# EasyEDA Pro project 数控电源_V3.eprj, board 屏幕排线fpc
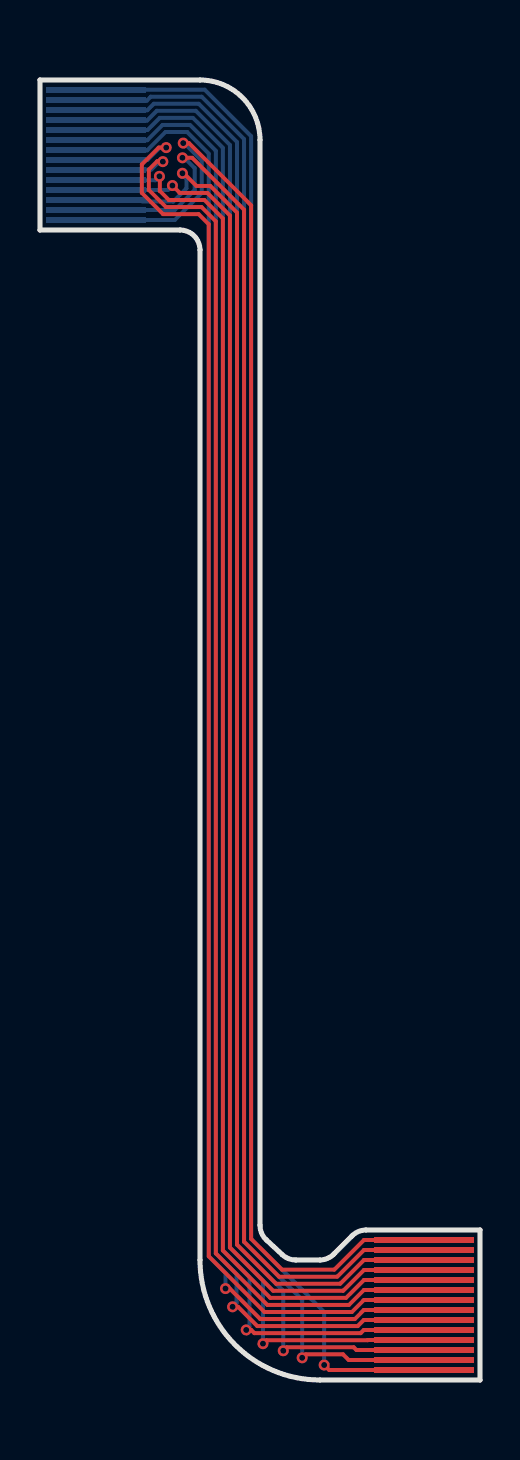
[diagram p11: board, top side]
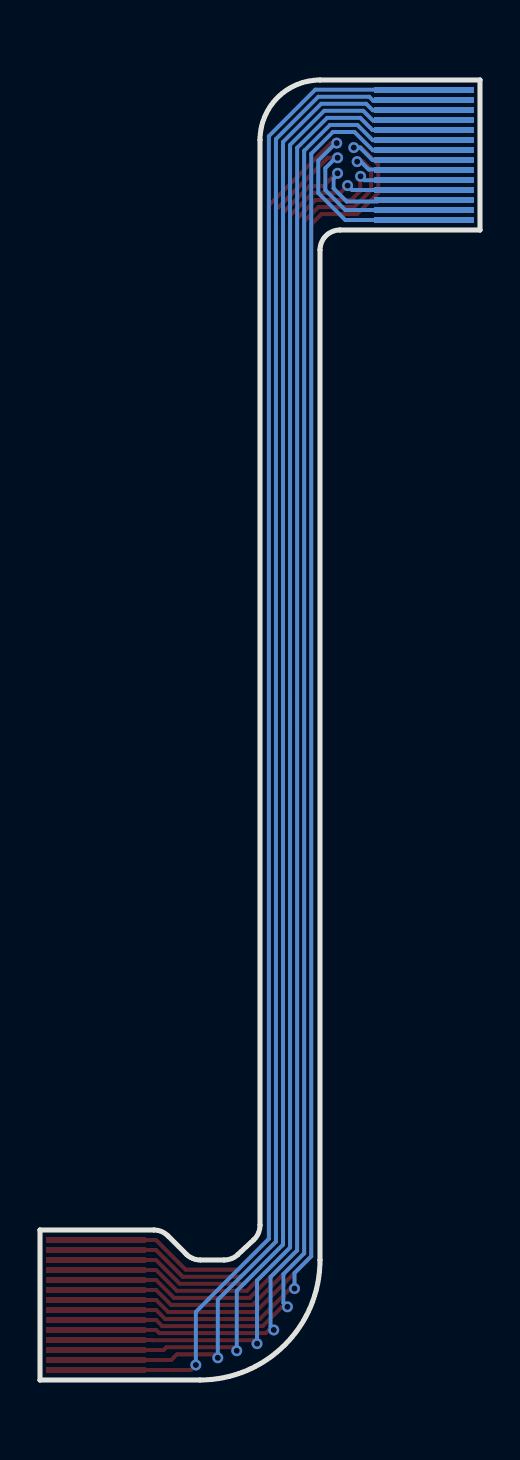
[diagram p12: board, bottom side, seen from below]

Outline 22 x 65 mm; copper layers: Top Layer, Bottom Layer. Coordinates in mm from the lower left corner of the outline.
Outline path: 0,65 8,65 arc(10.12,64.12) 11,62 11,7.74 arc(11.08,7.34) 11.32,7 12.11,6.27 arc(12.43,6.07) 12.79,6 13.98,6 arc(14.36,6.08) 14.69,6.29 15.6,7.21 arc(15.93,7.42) 16.31,7.5 22,7.5 22,0 14,0 arc(9.76,1.76) 8,6 8,56.5 arc(7.71,57.21) 7,57.5 0,57.5 0,65
Stack: Top Layer 0.035mm / Dielectric1 1.51mm FR4 er 4.5 / Bottom Layer 0.035mm

## Design rules (mm)
spacing copperThickness1oz (default): track to track 0.152, other pairs 0.152 to 0.3
spacing copperThickness2oz: track to track 0.203, other pairs 0.152 to 0.3
spacing Plane_innerPlane: track to track 0.152, other pairs 0.152 to 0.3
spacing Copper_copperRegion: track to track 0.152, other pairs 0.152 to 0.3
track width copperThickness1oz (default): min 0.127, default 0.254, max 2.54
track width copperThickness2oz: min 0.203, default 0.254, max 2.54
differential pair differentialPair (default): width min 0.127, default 0.254, max 2.54; gap min 0.152, default 0.152

## Placement (name value [footprint] x y rotation side)
J1  -  [TFT-14PIN-0.5]  2.8 61.25 180 bottom
J2  -  [TFT-14PIN-0.5]  19.2 3.75 180 top

## Footprints (pads in the part's own frame, mm; a bottom-side part is the same pattern mirrored in y, then rotated)
TFT-14PIN-0.5
  rect 5x0.3 smd: 1(0,3.25) 2(0,2.75) 3(0,2.25) 4(0,1.75) 5(0,1.25) 6(0,0.75) 7(0,0.25) 8(0,-0.25) 9(0,-0.75) 10(0,-1.25) 11(0,-1.75) 12(0,-2.25) 13(0,-2.75) 14(0,-3.25)

## Nets
As in the schematic.

## Via types
v1: diameter 0.55, hole 0.3, Top Layer to Bottom Layer, 14 vias

## Routing (per net, layer and track width the routed paths; a pad name or vN(x,y) marks a point on that pad's centre or on a via; arc(x,y) is an arc through that point)
$1N352: length 76.8
  Top Layer w0.201: J2.1 14.45,0.5 14.21,0.75 v1(14.21,0.75)
  Bottom Layer w0.201: v1(14.21,0.75) 14.21,3.4 13.56,4.05 13.56,4.05 10.56,7.06 10.56,62.19 8.23,64.52 2.82,64.52 J1.1
$1N354: length 76.8
  Top Layer w0.201: J2.2 15.44,1 15.15,1.28 13.28,1.28 13.11,1.11 v1(13.11,1.11)
  Bottom Layer w0.201: J1.2 2.84,63.96 5.34,63.96 5.54,64.16 8.08,64.16 10.2,62.05 10.2,6.91 13.11,4.01 v1(13.11,1.11)
$1N356: length 76.5
  Top Layer w0.201: v1(12.16,1.46) 12.34,1.64 15.68,1.64 15.82,1.5 J2.3
  Bottom Layer w0.201: J1.3 2.81,63.49 5.37,63.49 5.69,63.81 7.94,63.81 9.85,61.9 9.85,6.77 12.16,4.46 v1(12.16,1.46)
$1N358: length 76.4
  Top Layer w0.201: J2.4 16.4,2 16.39,1.99 11.32,1.99 v1(11.15,1.82)
  Bottom Layer w0.201: v1(11.15,1.82) 11.15,4.97 9.5,6.62 9.5,61.75 7.79,63.46 5.84,63.46 5.35,62.97 2.83,62.97 J1.4
$1N360: length 76
  Top Layer w0.201: J2.5 16.19,2.5 16.03,2.34 10.72,2.34 10.56,2.5 v1(10.31,2.5)
  Bottom Layer w0.201: J1.5 5.38,62.5 5.98,63.11 7.65,63.11 9.14,61.61 9.15,6.48 10.47,5.15 10.47,2.66 v1(10.31,2.5)
$1N362: length 75.3
  Top Layer w0.201: J2.6 16.19,3 15.89,2.7 10.86,2.7 9.9,3.66 v1(9.63,3.66)
  Bottom Layer w0.201: v1(9.63,3.66) 9.83,3.86 9.83,5.29 8.79,6.33 8.79,61.46 7.5,62.75 6.13,62.75 5.37,61.99 2.81,61.99 J1.6
$1N364: length 74.3
  Top Layer w0.201: J2.7 16.19,3.5 15.74,3.05 11.01,3.05 9.49,4.57 v1(9.28,4.57)
  Bottom Layer w0.201: v1(9.28,4.57) 9.28,5.35 8.44,6.18 8.44,61.32 7.35,62.4 6.28,62.4 5.36,61.48 2.81,61.48 J1.7
$1N366: length 74.5
  Top Layer w0.201: v1(6.31,61.62) 5.94,61.62 5.09,60.78 5.09,59.35 6.15,58.29 7.93,58.29 8.44,57.79 8.44,6.18 11.22,3.4 15.59,3.4 16.19,4 J2.8
  Bottom Layer w0.201: J1.8 5.37,61 6,61.62 v1(6.31,61.62)
$1N368: length 70.4
  Top Layer w0.201: v1(6.14,60.92) 6.12,60.94 5.86,60.94 5.44,60.52 5.44,59.5 6.3,58.65 8.08,58.65 8.79,57.93 8.79,6.33 11.37,3.75 15.45,3.75 16.19,4.5 J2.9
  Bottom Layer w0.201: v1(6.14,60.92) 5.96,60.92 5.57,60.53 5.17,60.53
$1N370: length 68.5
  Top Layer w0.201: v1(5.97,60.18) 5.99,60.16 5.99,59.45 6.44,59 8.22,59 9.14,58.08 9.14,6.47 11.51,4.11 15.3,4.11 16.2,5 J2.10
  Bottom Layer w0.201: v1(5.97,60.18) 5.78,59.99 5.01,59.99
$1N372: length 70
  Top Layer w0.201: v1(6.62,59.72) 6.99,59.35 8.37,59.35 9.5,58.22 9.5,6.62 11.66,4.46 15.16,4.46 16.2,5.5 J2.11
  Bottom Layer w0.201: J1.11 6.4,59.5 v1(6.62,59.72)
$1N374: length 69.1
  Top Layer w0.201: v1(7.12,60.33) 7.19,60.33 7.82,59.7 8.51,59.7 9.85,58.37 9.85,6.77 11.81,4.81 15.01,4.81 16.2,6 J2.12
  Bottom Layer w0.201: v1(7.12,60.33) 7.12,60.27 7.32,60.08 7.32,59.58 6.66,58.92 5.12,58.92
$1N376: length 73.3
  Top Layer w0.201: J2.13 16.2,6.5 14.86,5.16 11.95,5.16 10.2,6.91 10.2,58.52 7.61,61.11 v1(7.12,61.11)
  Bottom Layer w0.201: v1(7.12,61.11) 7.17,61.16 7.73,60.59 7.73,59.5 6.74,58.5 J1.13
$1N378: length 75
  Top Layer w0.201: v1(7.16,61.85) 7.45,61.85 10.56,58.74 10.56,7.06 12.1,5.52 14.72,5.52 16.2,7 J2.14
  Bottom Layer w0.201: v1(7.16,61.85) 7.21,61.85 8.09,60.97 8.09,59.35 6.74,58 J1.14
